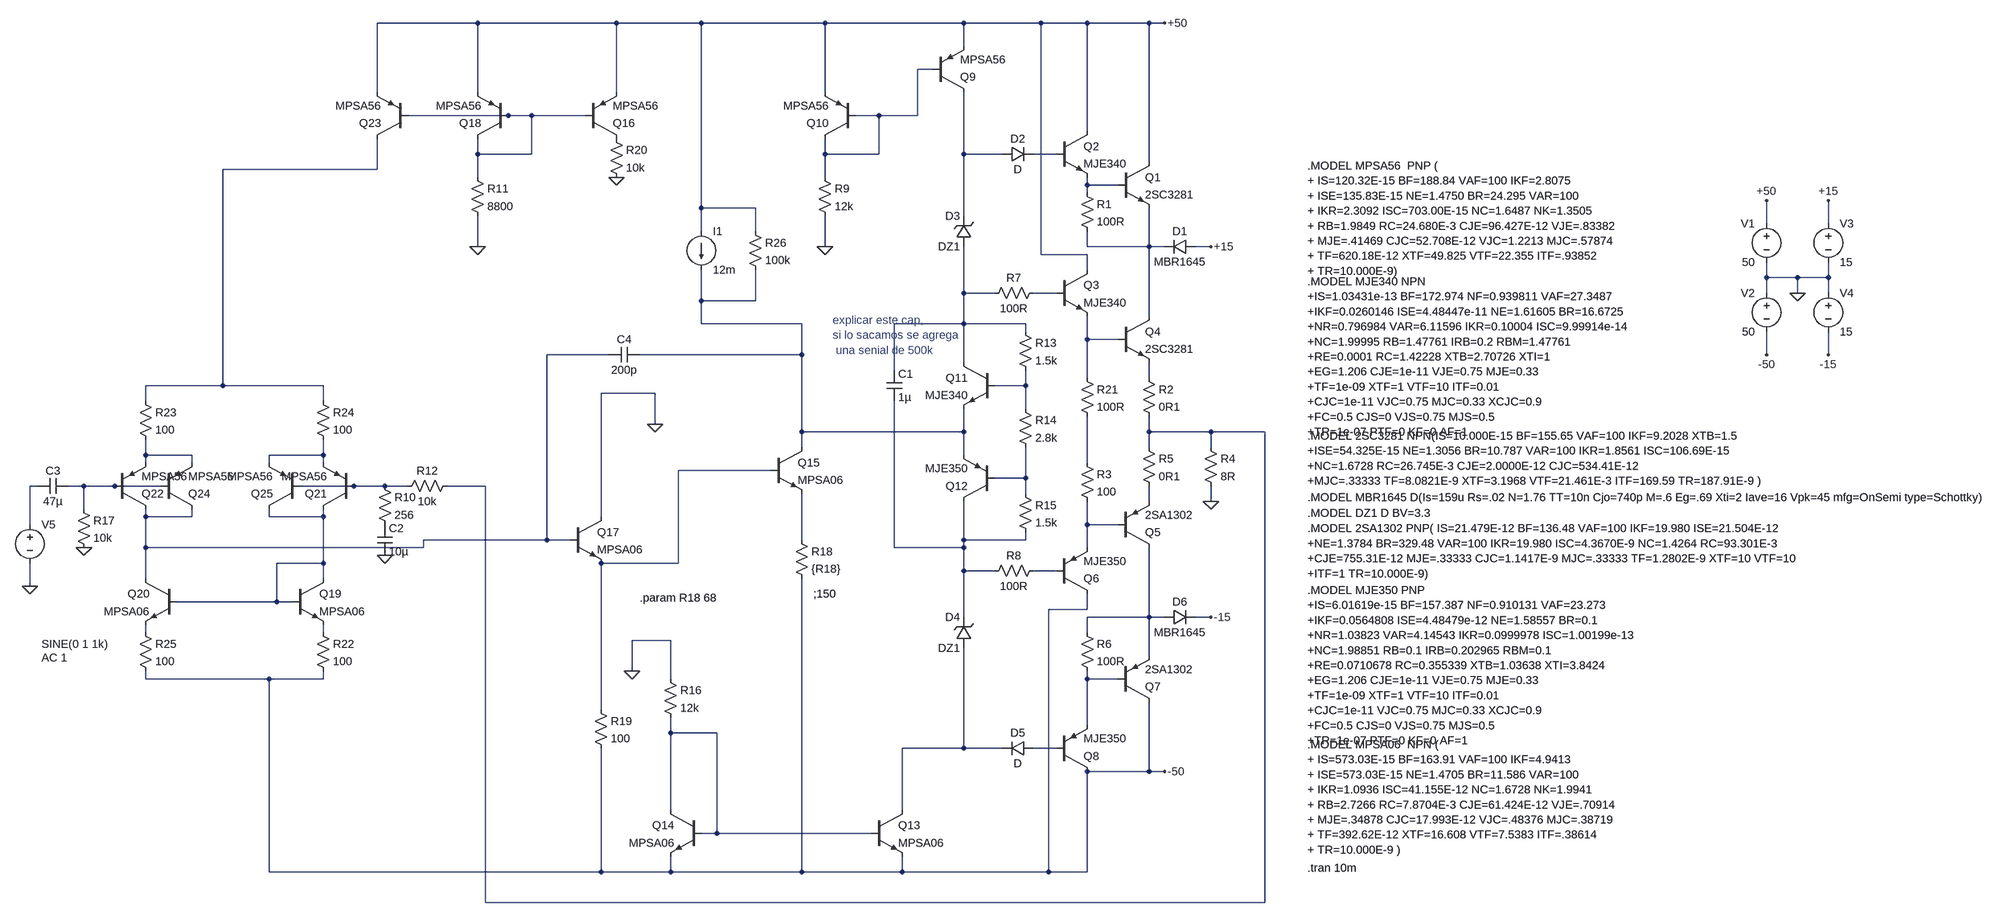
[diagram p0: schematic ampli_g_8_8_15.asc]
ampli_g_8_8_15.asc, the LTspice schematic file:
Version 4
SHEET 1 4192 680
WIRE 848 -1584 640 -1584
WIRE 1136 -1584 848 -1584
WIRE 1312 -1584 1136 -1584
WIRE 1568 -1584 1312 -1584
WIRE 1856 -1584 1568 -1584
WIRE 2016 -1584 1856 -1584
WIRE 2112 -1584 2016 -1584
WIRE 2240 -1584 2112 -1584
WIRE 2272 -1584 2240 -1584
WIRE 1856 -1536 1856 -1584
WIRE 1792 -1488 1760 -1488
WIRE 640 -1440 640 -1584
WIRE 848 -1440 848 -1584
WIRE 1136 -1440 1136 -1584
WIRE 1568 -1440 1568 -1584
WIRE 912 -1392 704 -1392
WIRE 960 -1392 912 -1392
WIRE 1072 -1392 960 -1392
WIRE 1680 -1392 1632 -1392
WIRE 1760 -1392 1760 -1488
WIRE 1760 -1392 1680 -1392
WIRE 2112 -1360 2112 -1584
WIRE 848 -1312 848 -1344
WIRE 960 -1312 960 -1392
WIRE 960 -1312 848 -1312
WIRE 1568 -1312 1568 -1344
WIRE 1680 -1312 1680 -1392
WIRE 1680 -1312 1568 -1312
WIRE 1856 -1312 1856 -1440
WIRE 1888 -1312 1856 -1312
WIRE 1936 -1312 1888 -1312
WIRE 2048 -1312 2000 -1312
WIRE 2240 -1296 2240 -1584
WIRE 640 -1280 640 -1344
WIRE 640 -1280 320 -1280
WIRE 848 -1264 848 -1312
WIRE 1568 -1264 1568 -1312
WIRE 2112 -1248 2112 -1264
WIRE 2176 -1248 2112 -1248
WIRE 2112 -1232 2112 -1248
WIRE 1312 -1200 1312 -1584
WIRE 1424 -1200 1312 -1200
WIRE 1856 -1184 1856 -1312
WIRE 3520 -1168 3520 -1216
WIRE 3648 -1168 3648 -1216
WIRE 1312 -1152 1312 -1200
WIRE 1424 -1152 1424 -1200
WIRE 848 -1120 848 -1184
WIRE 1568 -1120 1568 -1184
WIRE 2112 -1120 2112 -1152
WIRE 2240 -1120 2240 -1200
WIRE 2240 -1120 2112 -1120
WIRE 2272 -1120 2240 -1120
WIRE 2368 -1120 2336 -1120
WIRE 2016 -1104 2016 -1584
WIRE 2112 -1104 2016 -1104
WIRE 2112 -1072 2112 -1104
WIRE 3520 -1056 3520 -1088
WIRE 3584 -1056 3520 -1056
WIRE 3648 -1056 3648 -1088
WIRE 3648 -1056 3584 -1056
WIRE 1856 -1024 1856 -1120
WIRE 1920 -1024 1856 -1024
WIRE 2048 -1024 2000 -1024
WIRE 3520 -1024 3520 -1056
WIRE 3584 -1024 3584 -1056
WIRE 3648 -1024 3648 -1056
WIRE 1312 -1008 1312 -1072
WIRE 1424 -1008 1424 -1072
WIRE 1424 -1008 1312 -1008
WIRE 2240 -976 2240 -1120
WIRE 1312 -960 1312 -1008
WIRE 1520 -960 1312 -960
WIRE 1856 -960 1856 -1024
WIRE 1856 -960 1712 -960
WIRE 1984 -960 1856 -960
WIRE 1984 -944 1984 -960
WIRE 2112 -928 2112 -976
WIRE 2176 -928 2112 -928
WIRE 1120 -896 992 -896
WIRE 1520 -896 1520 -960
WIRE 1520 -896 1184 -896
WIRE 3520 -896 3520 -944
WIRE 3648 -896 3648 -944
WIRE 1856 -880 1856 -960
WIRE 1712 -864 1712 -960
WIRE 2112 -848 2112 -928
WIRE 2240 -848 2240 -880
WIRE 208 -832 160 -832
WIRE 320 -832 320 -1280
WIRE 320 -832 208 -832
WIRE 528 -832 320 -832
WIRE 1984 -832 1984 -864
WIRE 1984 -832 1920 -832
WIRE 1216 -816 1104 -816
WIRE 160 -800 160 -832
WIRE 528 -800 528 -832
WIRE 1984 -784 1984 -832
WIRE 1216 -752 1216 -816
WIRE 1520 -736 1520 -896
WIRE 1648 -736 1520 -736
WIRE 1856 -736 1856 -784
WIRE 1856 -736 1648 -736
WIRE 2240 -736 2240 -768
WIRE 2352 -736 2240 -736
WIRE 2368 -736 2352 -736
WIRE 2480 -736 2368 -736
WIRE 1520 -704 1520 -736
WIRE 2240 -704 2240 -736
WIRE 2368 -704 2368 -736
WIRE 160 -688 160 -720
WIRE 256 -688 160 -688
WIRE 528 -688 528 -720
WIRE 528 -688 416 -688
WIRE 1856 -688 1856 -736
WIRE 160 -672 160 -688
WIRE 256 -672 256 -688
WIRE 416 -672 416 -688
WIRE 528 -672 528 -688
WIRE 2112 -672 2112 -768
WIRE 1280 -656 1264 -656
WIRE 1456 -656 1280 -656
WIRE 1984 -640 1984 -704
WIRE 1984 -640 1920 -640
WIRE -64 -624 -80 -624
WIRE 32 -624 0 -624
WIRE 96 -624 32 -624
WIRE 192 -624 96 -624
WIRE 592 -624 480 -624
WIRE 656 -624 592 -624
WIRE 704 -624 656 -624
WIRE 864 -624 784 -624
WIRE 1984 -608 1984 -640
WIRE 2240 -592 2240 -624
WIRE 2368 -592 2368 -624
WIRE 32 -576 32 -624
WIRE 160 -560 160 -576
WIRE 256 -560 256 -576
WIRE 256 -560 160 -560
WIRE 416 -560 416 -576
WIRE 528 -560 528 -576
WIRE 528 -560 416 -560
WIRE 1104 -560 1104 -816
WIRE -80 -544 -80 -624
WIRE 1520 -544 1520 -608
WIRE 2112 -544 2112 -592
WIRE 2176 -544 2112 -544
WIRE 160 -512 160 -560
WIRE 992 -512 992 -896
WIRE 992 -512 736 -512
WIRE 1040 -512 992 -512
WIRE 1520 -512 1520 -544
WIRE 1856 -512 1856 -592
WIRE 1984 -512 1984 -528
WIRE 1984 -512 1856 -512
WIRE 160 -496 160 -512
WIRE 736 -496 736 -512
WIRE 736 -496 160 -496
WIRE 1712 -496 1712 -800
WIRE 1856 -496 1856 -512
WIRE 1856 -496 1712 -496
WIRE 2112 -496 2112 -544
WIRE 528 -464 528 -560
WIRE 528 -464 432 -464
WIRE 1264 -464 1264 -656
WIRE 1264 -464 1104 -464
WIRE 1856 -448 1856 -496
WIRE 1920 -448 1856 -448
WIRE 2048 -448 2000 -448
WIRE 160 -432 160 -496
WIRE 528 -432 528 -464
WIRE -80 -416 -80 -464
WIRE 336 -384 224 -384
WIRE 432 -384 432 -464
WIRE 432 -384 336 -384
WIRE 464 -384 432 -384
WIRE 1104 -368 1104 -464
WIRE 2112 -368 2112 -400
WIRE 2112 -368 2032 -368
WIRE 1856 -352 1856 -448
WIRE 2240 -352 2240 -496
WIRE 2240 -352 2112 -352
WIRE 2272 -352 2240 -352
WIRE 2368 -352 2336 -352
WIRE 160 -320 160 -336
WIRE 528 -320 528 -336
WIRE 2112 -320 2112 -352
WIRE 1248 -304 1168 -304
WIRE 2240 -272 2240 -352
WIRE 1168 -240 1168 -304
WIRE 160 -224 160 -240
WIRE 416 -224 160 -224
WIRE 528 -224 528 -240
WIRE 528 -224 416 -224
WIRE 1248 -224 1248 -304
WIRE 2112 -224 2112 -240
WIRE 2176 -224 2112 -224
WIRE 1104 -160 1104 -368
WIRE 2112 -128 2112 -224
WIRE 1248 -112 1248 -144
WIRE 1344 -112 1248 -112
WIRE 1856 -80 1856 -288
WIRE 1856 -80 1728 -80
WIRE 1888 -80 1856 -80
WIRE 1936 -80 1888 -80
WIRE 2048 -80 2000 -80
WIRE 2240 -32 2240 -176
WIRE 2240 -32 2112 -32
WIRE 2272 -32 2240 -32
WIRE 1248 48 1248 -112
WIRE 1728 48 1728 -80
WIRE 1344 96 1344 -112
WIRE 1344 96 1312 96
WIRE 1664 96 1344 96
WIRE 416 176 416 -224
WIRE 1104 176 1104 -80
WIRE 1104 176 416 176
WIRE 1248 176 1248 144
WIRE 1248 176 1104 176
WIRE 1520 176 1520 -432
WIRE 1520 176 1248 176
WIRE 1728 176 1728 144
WIRE 1728 176 1520 176
WIRE 2032 176 2032 -368
WIRE 2032 176 1728 176
WIRE 2112 176 2112 -32
WIRE 2112 176 2032 176
WIRE 864 240 864 -624
WIRE 2480 240 2480 -736
WIRE 2480 240 864 240
FLAG 2368 -592 0
FLAG 2272 -32 -50
FLAG 2368 -352 -15
FLAG 2272 -1584 +50
FLAG 2368 -1120 +15
FLAG 1168 -240 0
FLAG 3520 -1216 +50
FLAG 3520 -896 -50
FLAG 3648 -1216 +15
FLAG 3648 -896 -15
FLAG 3584 -1024 0
FLAG 1216 -752 0
FLAG -80 -416 0
FLAG 1568 -1120 0
FLAG 848 -1120 0
FLAG 32 -496 0
FLAG 656 -480 0
FLAG 1136 -1264 0
DATAFLAG 1888 -1312 ""
DATAFLAG 1888 -80 ""
DATAFLAG 1344 -112 ""
DATAFLAG 2352 -736 ""
DATAFLAG 1648 -736 ""
DATAFLAG 1520 -544 ""
DATAFLAG 1280 -656 ""
DATAFLAG 1104 -368 ""
DATAFLAG 1984 -832 ""
DATAFLAG 208 -832 ""
DATAFLAG 336 -384 ""
DATAFLAG 160 -512 ""
SYMBOL npn 2176 -1296 R0
SYMATTR InstName Q1
SYMATTR Value 2SC3281
SYMBOL npn 2048 -1360 R0
SYMATTR InstName Q2
SYMATTR Value MJE340
SYMBOL res 2096 -1248 R0
SYMATTR InstName R1
SYMATTR Value 100R
SYMBOL diode 2336 -1136 R90
WINDOW 0 0 32 VBottom 2
WINDOW 3 32 32 VTop 2
SYMATTR InstName D1
SYMATTR Value MBR1645
SYMBOL diode 1936 -1296 R270
WINDOW 0 32 32 VTop 2
WINDOW 3 0 32 VBottom 2
SYMATTR InstName D2
SYMBOL zener 1872 -1120 R180
WINDOW 0 24 64 Left 2
WINDOW 3 24 0 Left 2
SYMATTR InstName D3
SYMATTR Value DZ1
SYMBOL npn 2048 -1072 R0
SYMATTR InstName Q3
SYMATTR Value MJE340
SYMBOL npn 2176 -976 R0
SYMATTR InstName Q4
SYMATTR Value 2SC3281
SYMBOL res 2224 -864 R0
SYMATTR InstName R2
SYMATTR Value 0R1
SYMBOL res 2096 -688 R0
SYMATTR InstName R3
SYMATTR Value 100
SYMBOL res 2352 -720 R0
SYMATTR InstName R4
SYMATTR Value 8R
SYMBOL res 2224 -720 R0
SYMATTR InstName R5
SYMATTR Value 0R1
SYMBOL pnp 2176 -496 M180
SYMATTR InstName Q5
SYMATTR Value 2SA1302
SYMBOL pnp 2048 -400 M180
SYMATTR InstName Q6
SYMATTR Value MJE350
SYMBOL pnp 2176 -176 M180
SYMATTR InstName Q7
SYMATTR Value 2SA1302
SYMBOL pnp 2048 -32 M180
SYMATTR InstName Q8
SYMATTR Value MJE350
SYMBOL res 2096 -336 R0
SYMATTR InstName R6
SYMATTR Value 100R
SYMBOL zener 1872 -288 R180
WINDOW 0 24 64 Left 2
WINDOW 3 24 0 Left 2
SYMATTR InstName D4
SYMATTR Value DZ1
SYMBOL diode 2000 -96 R90
WINDOW 0 0 32 VBottom 2
WINDOW 3 32 32 VTop 2
SYMATTR InstName D5
SYMBOL diode 2272 -336 R270
WINDOW 0 32 32 VTop 2
WINDOW 3 0 32 VBottom 2
SYMATTR InstName D6
SYMATTR Value MBR1645
SYMBOL res 2016 -1040 R90
WINDOW 0 0 56 VBottom 2
WINDOW 3 32 56 VTop 2
SYMATTR InstName R7
SYMATTR Value 100R
SYMBOL res 2016 -464 R90
WINDOW 0 0 56 VBottom 2
WINDOW 3 32 56 VTop 2
SYMATTR InstName R8
SYMATTR Value 100R
SYMBOL npn 1920 -880 M0
SYMATTR InstName Q11
SYMATTR Value MJE340
SYMBOL pnp 1920 -592 R180
SYMATTR InstName Q12
SYMATTR Value MJE350
SYMBOL res 1968 -960 R0
SYMATTR InstName R13
SYMATTR Value 1.5k
SYMBOL res 1968 -800 R0
SYMATTR InstName R14
SYMATTR Value 2.8k
SYMBOL res 1968 -624 R0
SYMATTR InstName R15
SYMATTR Value 1.5k
SYMBOL npn 1664 48 R0
SYMATTR InstName Q13
SYMATTR Value MPSA06
SYMBOL npn 1312 48 M0
SYMATTR InstName Q14
SYMATTR Value MPSA06
SYMBOL res 1232 -240 R0
SYMATTR InstName R16
SYMATTR Value 12k
SYMBOL voltage 3520 -1184 M0
SYMATTR InstName V1
SYMATTR Value 50
SYMBOL voltage 3520 -1040 M0
SYMATTR InstName V2
SYMATTR Value 50
SYMBOL voltage 3648 -1184 R0
SYMATTR InstName V3
SYMATTR Value 15
SYMBOL voltage 3648 -1040 R0
SYMATTR InstName V4
SYMATTR Value 15
SYMBOL npn 1456 -704 R0
SYMATTR InstName Q15
SYMATTR Value MPSA06
SYMBOL res 1504 -528 R0
SYMATTR InstName R18
SYMATTR Value {R18}
SYMBOL npn 1040 -560 R0
SYMATTR InstName Q17
SYMATTR Value MPSA06
SYMBOL res 1088 -176 R0
SYMATTR InstName R19
SYMATTR Value 100
SYMBOL res 2096 -864 R0
SYMATTR InstName R21
SYMATTR Value 100R
SYMBOL cap 1696 -864 R0
SYMATTR InstName C1
SYMATTR Value 1µ
SYMBOL npn 464 -432 R0
SYMATTR InstName Q19
SYMATTR Value MPSA06
SYMBOL npn 224 -432 M0
SYMATTR InstName Q20
SYMATTR Value MPSA06
SYMBOL pnp 592 -576 R180
SYMATTR InstName Q21
SYMATTR Value MPSA56
SYMBOL voltage -80 -560 R0
WINDOW 123 24 292 Left 2
WINDOW 39 0 0 Left 2
WINDOW 3 24 264 Left 2
SYMATTR Value2 AC 1
SYMATTR Value SINE(0 1 1k)
SYMATTR InstName V5
SYMBOL pnp 96 -576 M180
SYMATTR InstName Q22
SYMATTR Value MPSA56
SYMBOL res 512 -336 R0
SYMATTR InstName R22
SYMATTR Value 100
SYMBOL res 144 -816 R0
SYMATTR InstName R23
SYMATTR Value 100
SYMBOL res 512 -816 R0
SYMATTR InstName R24
SYMATTR Value 100
SYMBOL res 144 -336 R0
SYMATTR InstName R25
SYMATTR Value 100
SYMBOL pnp 1792 -1440 M180
SYMATTR InstName Q9
SYMATTR Value MPSA56
SYMBOL pnp 1632 -1344 R180
SYMATTR InstName Q10
SYMATTR Value MPSA56
SYMBOL res 1552 -1280 R0
SYMATTR InstName R9
SYMATTR Value 12k
SYMBOL pnp 1072 -1344 M180
SYMATTR InstName Q16
SYMATTR Value MPSA56
SYMBOL pnp 912 -1344 R180
SYMATTR InstName Q18
SYMATTR Value MPSA56
SYMBOL res 832 -1280 R0
SYMATTR InstName R11
SYMATTR Value 8800
SYMBOL pnp 704 -1344 R180
SYMATTR InstName Q23
SYMATTR Value MPSA56
SYMBOL res 640 -640 R0
SYMATTR InstName R10
SYMATTR Value 256
SYMBOL res 800 -640 R90
WINDOW 0 0 56 VBottom 2
WINDOW 3 32 56 VTop 2
SYMATTR InstName R12
SYMATTR Value 10k
SYMBOL pnp 192 -576 M180
SYMATTR InstName Q24
SYMATTR Value MPSA56
SYMBOL pnp 480 -576 R180
SYMATTR InstName Q25
SYMATTR Value MPSA56
SYMBOL res 16 -592 R0
SYMATTR InstName R17
SYMATTR Value 10k
SYMBOL cap 640 -544 R0
SYMATTR InstName C2
SYMATTR Value 10µ
SYMBOL cap 0 -640 R90
WINDOW 0 0 32 VBottom 2
WINDOW 3 32 32 VTop 2
SYMATTR InstName C3
SYMATTR Value 47µ
SYMBOL cap 1184 -912 R90
WINDOW 0 0 32 VBottom 2
WINDOW 3 32 32 VTop 2
SYMATTR InstName C4
SYMATTR Value 200p
SYMBOL res 1120 -1360 R0
SYMATTR InstName R20
SYMATTR Value 10k
SYMBOL current 1312 -1152 R0
WINDOW 123 0 0 Left 2
WINDOW 39 0 0 Left 2
SYMATTR InstName I1
SYMATTR Value 12m
SYMBOL res 1408 -1168 R0
SYMATTR InstName R26
SYMATTR Value 100k
TEXT 2568 168 Left 2 !.tran 10m
TEXT 2568 -568 Left 2 !.MODEL DZ1 D BV=3.3
TEXT 2568 -1288 Left 2 !.MODEL MPSA56  PNP (\n+ IS=120.32E-15 BF=188.84 VAF=100 IKF=2.8075\n+ ISE=135.83E-15 NE=1.4750 BR=24.295 VAR=100\n+ IKR=2.3092 ISC=703.00E-15 NC=1.6487 NK=1.3505\n+ RB=1.9849 RC=24.680E-3 CJE=96.427E-12 VJE=.83382\n+ MJE=.41469 CJC=52.708E-12 VJC=1.2213 MJC=.57874\n+ TF=620.18E-12 XTF=49.825 VTF=22.355 ITF=.93852\n+ TR=10.000E-9)
TEXT 2568 -1048 Left 2 !.MODEL MJE340 NPN\n+IS=1.03431e-13 BF=172.974 NF=0.939811 VAF=27.3487\n+IKF=0.0260146 ISE=4.48447e-11 NE=1.61605 BR=16.6725\n+NR=0.796984 VAR=6.11596 IKR=0.10004 ISC=9.99914e-14\n+NC=1.99995 RB=1.47761 IRB=0.2 RBM=1.47761\n+RE=0.0001 RC=1.42228 XTB=2.70726 XTI=1\n+EG=1.206 CJE=1e-11 VJE=0.75 MJE=0.33\n+TF=1e-09 XTF=1 VTF=10 ITF=0.01\n+CJC=1e-11 VJC=0.75 MJC=0.33 XCJC=0.9\n+FC=0.5 CJS=0 VJS=0.75 MJS=0.5\n+TR=1e-07 PTF=0 KF=0 AF=1
TEXT 2568 -728 Left 2 !.MODEL 2SC3281 NPN(IS=10.000E-15 BF=155.65 VAF=100 IKF=9.2028 XTB=1.5\n+ISE=54.325E-15 NE=1.3056 BR=10.787 VAR=100 IKR=1.8561 ISC=106.69E-15\n+NC=1.6728 RC=26.745E-3 CJE=2.0000E-12 CJC=534.41E-12\n+MJC=.33333 TF=8.0821E-9 XTF=3.1968 VTF=21.461E-3 ITF=169.59 TR=187.91E-9 )
TEXT 2568 -600 Left 2 !.MODEL MBR1645 D(Is=159u Rs=.02 N=1.76 TT=10n Cjo=740p M=.6 Eg=.69 Xti=2 Iave=16 Vpk=45 mfg=OnSemi type=Schottky)
TEXT 2568 -536 Left 2 !.MODEL 2SA1302 PNP( IS=21.479E-12 BF=136.48 VAF=100 IKF=19.980 ISE=21.504E-12\n+NE=1.3784 BR=329.48 VAR=100 IKR=19.980 ISC=4.3670E-9 NC=1.4264 RC=93.301E-3\n+CJE=755.31E-12 MJE=.33333 CJC=1.1417E-9 MJC=.33333 TF=1.2802E-9 XTF=10 VTF=10\n+ITF=1 TR=10.000E-9)
TEXT 2568 -408 Left 2 !.MODEL MJE350 PNP\n+IS=6.01619e-15 BF=157.387 NF=0.910131 VAF=23.273\n+IKF=0.0564808 ISE=4.48479e-12 NE=1.58557 BR=0.1\n+NR=1.03823 VAR=4.14543 IKR=0.0999978 ISC=1.00199e-13\n+NC=1.98851 RB=0.1 IRB=0.202965 RBM=0.1\n+RE=0.0710678 RC=0.355339 XTB=1.03638 XTI=3.8424\n+EG=1.206 CJE=1e-11 VJE=0.75 MJE=0.33\n+TF=1e-09 XTF=1 VTF=10 ITF=0.01\n+CJC=1e-11 VJC=0.75 MJC=0.33 XCJC=0.9\n+FC=0.5 CJS=0 VJS=0.75 MJS=0.5\n+TR=1e-07 PTF=0 KF=0 AF=1
TEXT 2568 -88 Left 2 !.MODEL MPSA06  NPN (\n+ IS=573.03E-15 BF=163.91 VAF=100 IKF=4.9413\n+ ISE=573.03E-15 NE=1.4705 BR=11.586 VAR=100\n+ IKR=1.0936 ISC=41.155E-12 NC=1.6728 NK=1.9941\n+ RB=2.7266 RC=7.8704E-3 CJE=61.424E-12 VJE=.70914\n+ MJE=.34878 CJC=17.993E-12 VJC=.48376 MJC=.38719\n+ TF=392.62E-12 XTF=16.608 VTF=7.5383 ITF=.38614\n+ TR=10.000E-9 )
TEXT 1184 -392 Left 2 !.param R18 68
TEXT 1544 -400 Left 2 !;150
TEXT 1584 -968 Left 2 ;explicar este cap, \nsi lo sacamos se agrega\n una senial de 500k

The netlist it stands for:
* ampli_g_8_8_15.asc
Q1 +50 N006 N007 0 2SC3281
Q2 +50 N004 N006 0 MJE340
R1 N006 N007 100R
D1 +15 N007 MBR1645
D2 N003 N004 D
D3 N008 N003 DZ1
Q3 +50 N009 N011 0 MJE340
Q4 N007 N011 N013 0 2SC3281
R2 N013 N015 0R1
R3 N018 N027 100
R4 N015 0 8R
R5 N015 N024 0R1
Q5 N030 N027 N024 0 2SA1302
Q6 -50 N029 N027 0 MJE350
Q7 -50 N033 N030 0 2SA1302
Q8 -50 N036 N033 0 MJE350
R6 N030 N033 100R
D4 N035 N028 DZ1
D5 N036 N035 D
D6 N030 -15 MBR1645
R7 N009 N008 100R
R8 N029 N028 100R
Q11 N008 N014 N010 0 MJE340
Q12 N028 N020 N010 0 MJE350
R13 N008 N014 1.5k
R14 N014 N020 2.8k
R15 N020 N028 1.5k
Q13 N035 N034 -50 0 MPSA06
Q14 N034 N034 -50 0 MPSA06
R16 0 N034 12k
V1 +50 0 50
V2 0 -50 50
V3 +15 0 15
V4 0 -15 15
Q15 N010 N019 N026 0 MPSA06
R18 N026 -50 {R18}
Q17 0 N012 N019 0 MPSA06
R19 N019 -50 100
R21 N011 N018 100R
C1 N008 N028 1µ
Q19 N025 N025 N032 0 MPSA06
Q20 N012 N025 N031 0 MPSA06
Q21 N025 N023 N017 0 MPSA56
V5 N021 0 SINE(0 1 1k) AC 1
Q22 N012 N022 N016 0 MPSA56
R22 N032 -50 100
R23 N005 N016 100
R24 N005 N017 100
R25 N031 -50 100
Q9 N003 N001 +50 0 MPSA56
Q10 N001 N001 +50 0 MPSA56
R9 N001 0 12k
Q16 P001 N002 +50 0 MPSA56
Q18 N002 N002 +50 0 MPSA56
R11 N002 0 8800
Q23 N005 N002 +50 0 MPSA56
R10 N023 P002 256
R12 N015 N023 10k
Q24 N012 N022 N016 0 MPSA56
Q25 N025 N023 N017 0 MPSA56
R17 N022 0 10k
C2 P002 0 10µ
C3 N022 N021 47µ
C4 N010 N012 200p
R20 P001 0 10k
I1 +50 N010 12m
R26 +50 N010 100k
.model D D
.lib standard.dio
.model NPN NPN
.model PNP PNP
.lib standard.bjt
.tran 10m
.MODEL DZ1 D BV=3.3
.MODEL MPSA56  PNP (
+ IS=120.32E-15 BF=188.84 VAF=100 IKF=2.8075
+ ISE=135.83E-15 NE=1.4750 BR=24.295 VAR=100
+ IKR=2.3092 ISC=703.00E-15 NC=1.6487 NK=1.3505
+ RB=1.9849 RC=24.680E-3 CJE=96.427E-12 VJE=.83382
+ MJE=.41469 CJC=52.708E-12 VJC=1.2213 MJC=.57874
+ TF=620.18E-12 XTF=49.825 VTF=22.355 ITF=.93852
+ TR=10.000E-9)
.MODEL MJE340 NPN
+IS=1.03431e-13 BF=172.974 NF=0.939811 VAF=27.3487
+IKF=0.0260146 ISE=4.48447e-11 NE=1.61605 BR=16.6725
+NR=0.796984 VAR=6.11596 IKR=0.10004 ISC=9.99914e-14
+NC=1.99995 RB=1.47761 IRB=0.2 RBM=1.47761
+RE=0.0001 RC=1.42228 XTB=2.70726 XTI=1
+EG=1.206 CJE=1e-11 VJE=0.75 MJE=0.33
+TF=1e-09 XTF=1 VTF=10 ITF=0.01
+CJC=1e-11 VJC=0.75 MJC=0.33 XCJC=0.9
+FC=0.5 CJS=0 VJS=0.75 MJS=0.5
+TR=1e-07 PTF=0 KF=0 AF=1
.MODEL 2SC3281 NPN(IS=10.000E-15 BF=155.65 VAF=100 IKF=9.2028 XTB=1.5
+ISE=54.325E-15 NE=1.3056 BR=10.787 VAR=100 IKR=1.8561 ISC=106.69E-15
+NC=1.6728 RC=26.745E-3 CJE=2.0000E-12 CJC=534.41E-12
+MJC=.33333 TF=8.0821E-9 XTF=3.1968 VTF=21.461E-3 ITF=169.59 TR=187.91E-9 )
.MODEL MBR1645 D(Is=159u Rs=.02 N=1.76 TT=10n Cjo=740p M=.6 Eg=.69 Xti=2 Iave=16 Vpk=45 mfg=OnSemi type=Schottky)
.MODEL 2SA1302 PNP( IS=21.479E-12 BF=136.48 VAF=100 IKF=19.980 ISE=21.504E-12
+NE=1.3784 BR=329.48 VAR=100 IKR=19.980 ISC=4.3670E-9 NC=1.4264 RC=93.301E-3
+CJE=755.31E-12 MJE=.33333 CJC=1.1417E-9 MJC=.33333 TF=1.2802E-9 XTF=10 VTF=10
+ITF=1 TR=10.000E-9)
.MODEL MJE350 PNP
+IS=6.01619e-15 BF=157.387 NF=0.910131 VAF=23.273
+IKF=0.0564808 ISE=4.48479e-12 NE=1.58557 BR=0.1
+NR=1.03823 VAR=4.14543 IKR=0.0999978 ISC=1.00199e-13
+NC=1.98851 RB=0.1 IRB=0.202965 RBM=0.1
+RE=0.0710678 RC=0.355339 XTB=1.03638 XTI=3.8424
+EG=1.206 CJE=1e-11 VJE=0.75 MJE=0.33
+TF=1e-09 XTF=1 VTF=10 ITF=0.01
+CJC=1e-11 VJC=0.75 MJC=0.33 XCJC=0.9
+FC=0.5 CJS=0 VJS=0.75 MJS=0.5
+TR=1e-07 PTF=0 KF=0 AF=1
.MODEL MPSA06  NPN (
+ IS=573.03E-15 BF=163.91 VAF=100 IKF=4.9413
+ ISE=573.03E-15 NE=1.4705 BR=11.586 VAR=100
+ IKR=1.0936 ISC=41.155E-12 NC=1.6728 NK=1.9941
+ RB=2.7266 RC=7.8704E-3 CJE=61.424E-12 VJE=.70914
+ MJE=.34878 CJC=17.993E-12 VJC=.48376 MJC=.38719
+ TF=392.62E-12 XTF=16.608 VTF=7.5383 ITF=.38614
+ TR=10.000E-9 )
.param R18 68
;150
* explicar este cap,
* si lo sacamos se agrega
*  una senial de 500k
.backanno
.end